# Altium schematic sheet RS485_promini_connecter.SchDoc
size A; SheetNumber: 1; SheetTotal: 1
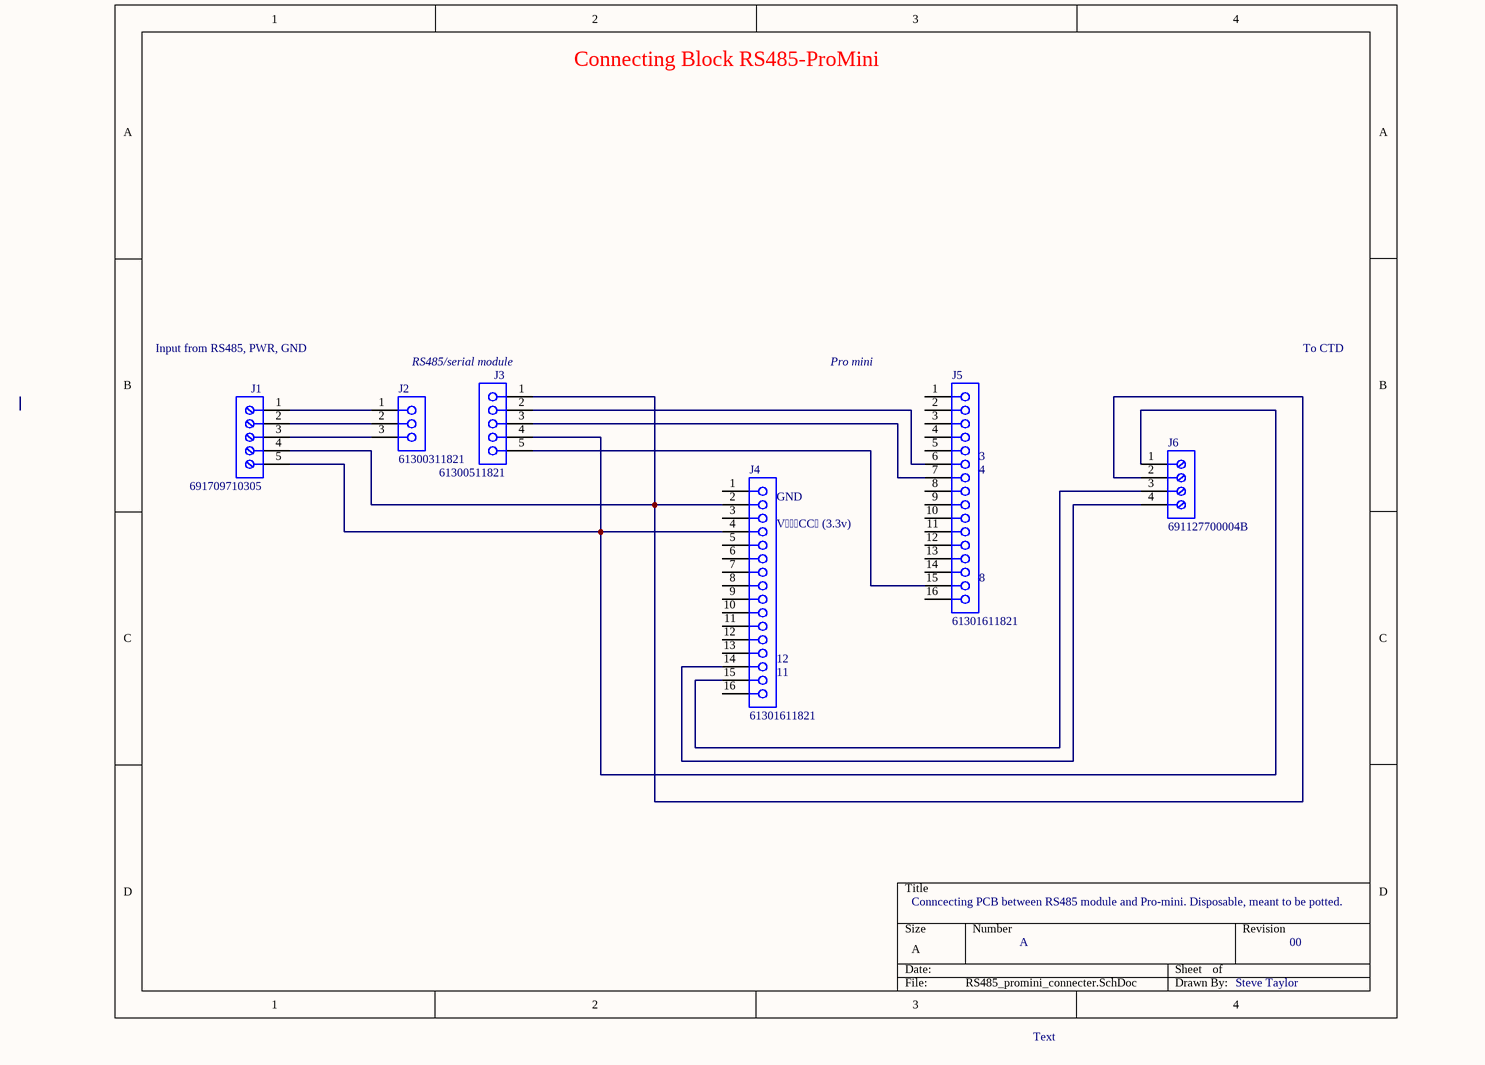
[diagram p0: RS485_promini_connecter.SchDoc]

## Parts
J1  691709710305  [691709710305]
J2  61300311821  [61300311821]
J3  61300511821  [61300511821]
J4  61301611821  [61301611821]
J5  61301611821  [61301611821]
J6  691127700004B  [691127700004B]

## Nets
NetJ1_1: J1.1 J2.1
NetJ1_2: J1.2 J2.2
NetJ1_3: J1.3 J2.3
NetJ1_4: J1.4 J3.1 J4.2 J6.2
NetJ1_5: J1.5 J3.4 J4.4 J6.1
NetJ3_2: J3.2 J5.6
NetJ3_3: J3.3 J5.7
NetJ3_5: J3.5 J5.15
NetJ4_14: J4.14 J6.4
NetJ4_15: J4.15 J6.3

Not connected (* = marked no-connect by the designer): J4 1 3 5 6 7 8 9 10 11 12 13 16; J5 1 2 3 4 5 8 9 10 11 12 13 14 16

## Notes on the sheet
- Connecting Block RS485-ProMini
- Input from RS485, PWR, GND
- RS485/serial module
- Pro mini
- To CTD
- (near J4) GND
- (near J5) 3
- (near J5) 4
- (near J4) VCC (3.3v)
- (near J5) 8
- (near J4) 12
- (near J4) 11
- Conncecting PCB between RS485 module and Pro-mini. Disposable, meant to be potted.
- A
- 00
- Text
- Steve Taylor

## Library data of the parts
J1 = CMP-1502-03338-3: Terminal Block, 5.0MM, Rising Cage Clamp, Horizontal, SMT, 30-14 AWG, 5 Pins; Voltage: 300V; Number of Levels: 1; Wire/Cable Gauge: 30AWG; Current: 6A; Wire Gauge (Min): 14AWG; Pitch: 5mm; Plating: Steel; Number of Positions Per Level: 5; Connector Type: Screw; Mount: Surface Mount; Flammability Rating: UL94 V-0; Contact Plating: Tin; Color: Black; Min Operating Temperature: -40°C; Number of Pins: 5; Length: 25mm; Lead Pitch: 5mm; Termination: Screw; Max Operating Temperature: 130°C; Current Rating: 6A; Packaging: Cut Tape (CT); Housing Material: Nylon; RoHS: Compliant; Number of Contacts: 5; Voltage Rating: 300V; Number of Positions: 5; Wire Gauge (Max): 30AWG
J2 = CMP-1502-01315-4: Btb Conn, Rcpt, 3Pos, 1Row, 2.54Mm Rohs Compliant: Yes; Current Rating: 3A; Operating Supply Voltage: 250V; Contact Resistance: 20mΩ; Gender: Female; Number of Pins: 3; Lead Pitch: 2.54mm; RoHS: Non-Compliant; Orientation: Vertical
J3 = CMP-1502-01320-4: THT Vertical Socket Header WR-PHD, Pitch 2.54 mm, Single Row, 5 pins; Gender: Female; Contact Resistance: 20mΩ; Operating Supply Voltage: 250V; Current Rating: 3A; Number of Pins: 5; Lead Pitch: 2.54mm; Orientation: Vertical
J4 J5 = CMP-1502-01343-4: THT Vertical Socket Header WR-PHD, Pitch 2.54 mm, Single Row, 16 pins; Gender: Female; Operating Supply Voltage: 250V; Contact Resistance: 20mΩ; Current Rating: 3A; Number of Pins: 16; Orientation: Vertical; Lead Pitch: 2.54mm; RoHS: Compliant; Lead Free: Lead Free; Contact Material: Copper
J6 = CMP-1502-03272-3: Terminal Block, 5MM Pitch, Vertical, Pressure Clamp, 30 to 12 AWG, 4 Pins, Grn; Stripping Length: 9mm; Number of Positions Per Level: 4; Plating: Steel; Wire/Cable Gauge: 30AWG; Current: 20A; Voltage: 300V; Pitch: 5.0038mm; Number of Levels: 1; Wire Gauge (Min): 12AWG; Connector Type: Terminal Block; Contact Plating: Tin; Mount: Through Hole; Lead Pitch: 5mm; Packaging: Box; RoHS: Compliant; Max Operating Temperature: 105°C; Wire Gauge (Max): 30AWG; Termination: Screw; Length: 18.6mm; Housing Material: Nylon; Contact Material: Brass; Width: 22.5mm; Number of Pins: 4; Min Operating Temperature: -40°C; REACH SVHC: Unknown; Color: Green; Height: 19.5mm; Number of Contacts: 4